# Altium schematic sheet 存储单元.schdoc
size 292 x 196 mm
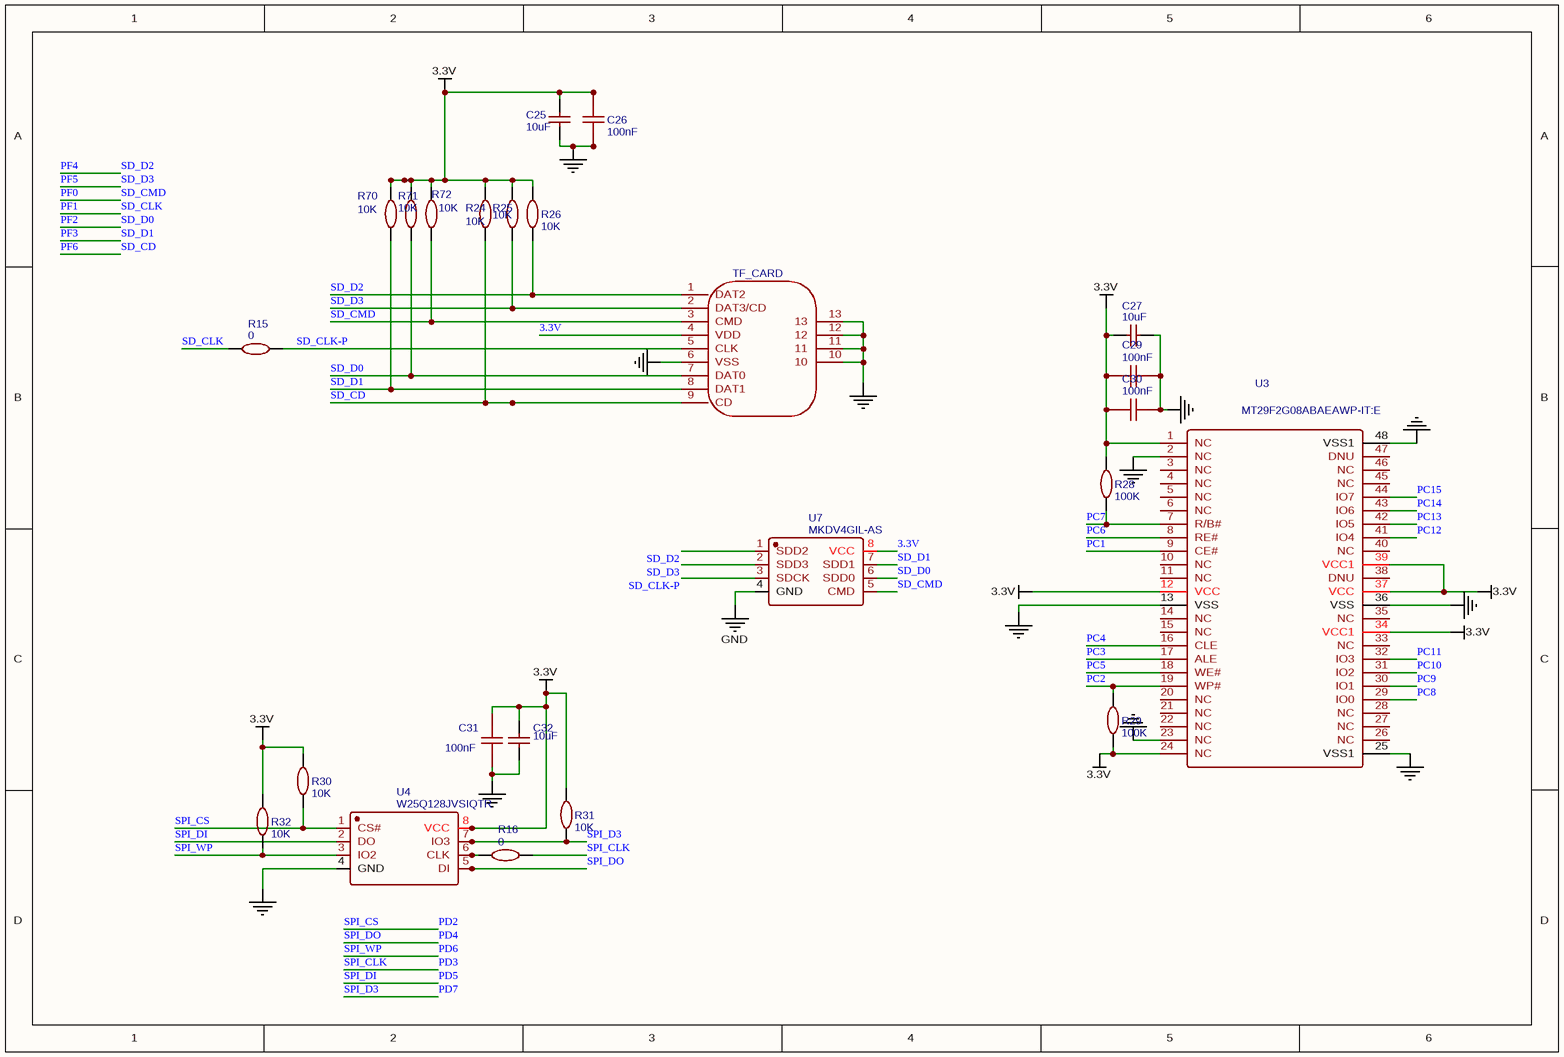
[diagram p0: 存储单元.schdoc]

## Parts
C25  10uF  [0805]
C26  100nF  [0603]
C27  10uF  [0805]
C29  100nF  [0603]
C30  100nF  [0603]
C31  100nF  [0603]
C32  10uF  [0805]
R15  0  [0603]
R16  0  [0603]
R24  10K  [0603]
R25  10K  [0603]
R26  10K  [0603]
R28  100K  [0603]
R29  100K  [0603]
R30  10K  [0603]
R31  10K  [0603]
R32  10K  [0603]
R70  10K  [0603]
R71  10K  [0603]
R72  10K  [0603]
TF_CARD1  TF_CARD  [TF-115_MRS]
U3  MT29F2G08ABAEAWP-IT:E  [TSOP-48]
U4  W25Q128JVSIQTR  [SOIC-8_208MIL]
U7  MKDV4GIL-AS  [LGA-8_8PIN-L6.10-W8.10-PITCH0.65-TL]

## Nets
3.3V: C25.2 C26.2 C27.2 C29.1 C30.2 C31.1 C32.1 R24.2 R25.2 R26.2 R28.2 R29.1 R30.2 R31.2 R32.2 R70.2 R71.2 R72.2 TF_CARD1.4(VDD) U3.1(NC) U3.12(VCC) U3.24(NC) U3.34(VCC1) U3.37(VCC) U3.39(VCC1) U4.8(VCC) U7.8(VCC)
GND: C25.1 C26.1 C27.1 C29.2 C30.1 C31.2 C32.2 TF_CARD1.6(VSS) TF_CARD1.10 TF_CARD1.11 TF_CARD1.12 TF_CARD1.13 U3.2(NC) U3.13(VSS) U3.23(NC) U3.25(VSS1) U3.36(VSS) U3.48(VSS1) U4.4(GND) U7.4(GND)
PC1: U3.9(CE#)
PC2: R29.2 U3.19(WP#)
PC3: U3.17(ALE)
PC4: U3.16(CLE)
PC5: U3.18(WE#)
PC6: U3.8(RE#)
PC7: R28.1 U3.7(R/B#)
PC8: U3.29(IO0)
PC9: U3.30(IO1)
PC10: U3.31(IO2)
PC11: U3.32(IO3)
PC12: U3.41(IO4)
PC13: U3.42(IO5)
PC14: U3.43(IO6)
PC15: U3.44(IO7)
PD2: R30.1 U4.1(CS#)  [also labelled SPI_CS]
PD3: R16.2  [also labelled SPI_CLK]
PD4: U4.5(DI)  [also labelled SPI_DO]
PD5: U4.2(DO)  [also labelled SPI_DI]
PD6: R32.1 U4.3(IO2)  [also labelled SPI_WP]
PD7: R31.1 U4.7(IO3)  [also labelled SPI_D3]
PF0: R72.1 TF_CARD1.3(CMD) U7.5(CMD)  [also labelled SD_CMD]
PF1: R15.1  [also labelled SD_CLK]
PF2: R71.1 TF_CARD1.7(DAT0) U7.6(SDD0)  [also labelled SD_D0]
PF3: R70.1 TF_CARD1.8(DAT1) U7.7(SDD1)  [also labelled SD_D1]
PF4: R26.1 TF_CARD1.1(DAT2) U7.1(SDD2)  [also labelled SD_D2]
PF5: R25.1 TF_CARD1.2(DAT3/CD) U7.2(SDD3)  [also labelled SD_D3]
PF6: R24.1 TF_CARD1.9(CD)  [also labelled SD_CD]
SD_CLK-P: R15.2 TF_CARD1.5(CLK) U7.3(SDCK)
NetR16_1: R16.1 U4.6(CLK)

Not connected (* = marked no-connect by the designer): U3 3(NC) 4(NC) 5(NC) 6(NC) 10(NC) 11(NC) 14(NC) 15(NC) 20(NC) 21(NC) 22(NC) 26(NC) 27(NC) 28(NC) 33(NC) 35(NC) 38(DNU) 40(NC) 45(NC) 46(NC) 47(DNU)

## Library data of the parts
C25 C27 C32 = 10uF: BOM_Manufacturer Part: CL21A106KAYNNNE; BOM_Manufacturer: SAMSUNG; nameAlias: Capacitance; BOM_Supplier: LCSC; BOM_LCSC Assembly: Yes; BOM_Supplier Part: C15850; spicePre: C; spiceSymbolName: CL21A106KAYNNNE
C26 C29-C31 = 100nF: BOM_Manufacturer: YAGEO; BOM_Manufacturer Part: CC0603KRX7R9BB104; nameAlias: Capacitance; SMT Type: Basic; BOM_Supplier: LCSC; BOM_LCSC Assembly: Yes; BOM_Supplier Part: C14663; spicePre: C; spiceSymbolName: CC0603KRX7R9BB104
R15 R16 = 0: BOM_Manufacturer: UniOhm; BOM_Manufacturer Part: 0603WAF0000T5E; nameAlias: Resistance (Ohms); SMT Type: Basic; BOM_Supplier: LCSC; BOM_LCSC Assembly: Yes; BOM_Supplier Part: C21189; spicePre: R; spiceSymbolName: 0603WAF0000T5E
R24-R26 R70-R72 = 10K: BOM_Manufacturer: UniOhm; BOM_Manufacturer Part: 0603WAF1002T5E; nameAlias: Resistance (Ohms); BOM_Supplier: LCSC; BOM_LCSC Assembly: Yes; BOM_Supplier Part: C25804; spicePre: R; spiceSymbolName: 0603WAF1002T5E
R28 R29 = 100K: BOM_Manufacturer: UniOhm; BOM_Manufacturer Part: 0603WAF1003T5E; nameAlias: Resistance (Ohms); SMT Type: Basic; BOM_Supplier: LCSC; BOM_LCSC Assembly: Yes; BOM_Supplier Part: C25803; spicePre: R; spiceSymbolName: 0603WAF1003T5E
R30-R32 = 10K: BOM_Manufacturer: UniOhm; BOM_Manufacturer Part: 0603WAF1002T5E; nameAlias: Resistance (Ohms); SMT Type: Basic; BOM_Supplier: LCSC; BOM_LCSC Assembly: Yes; BOM_Supplier Part: C25804; spicePre: R; spiceSymbolName: 0603WAF1002T5E
TF_CARD1 = TF_CARD: Contributor: ration; BOM_Manufacturer Part: ?; BOM_Supplier Part: undefined; spicePre: H
U3 = MT29F2G08ABAEAWP-IT:E: BOM_Manufacturer: Micron; Contributor: LCSC; SMT Type: Extend; BOM_Supplier: LCSC; BOM_Manufacturer Part: MT29F2G08ABAEAWP-IT:E; BOM_Supplier Part: C110896; BOM_LCSC Assembly: Yes; spicePre: U
U4 = W25Q128JVSIQTR: BOM_Manufacturer: WINBOND; SMT Type: Basic; BOM_Supplier: LCSC; BOM_Manufacturer Part: W25Q128JVSIQTR; BOM_Supplier Part: C97521; BOM_LCSC Assembly: Yes; spicePre: U
U7 = MKDV4GIL-AS: BOM_Manufacturer: MK; Contributor: LCSC; BOM_Supplier: LCSC; BOM_Supplier Part: C379093; BOM_Manufacturer Part: MKDV4GIL-AS; spicePre: U